# EAGLE design TauryCurrentSenseAmp (EAGLE 6.4)
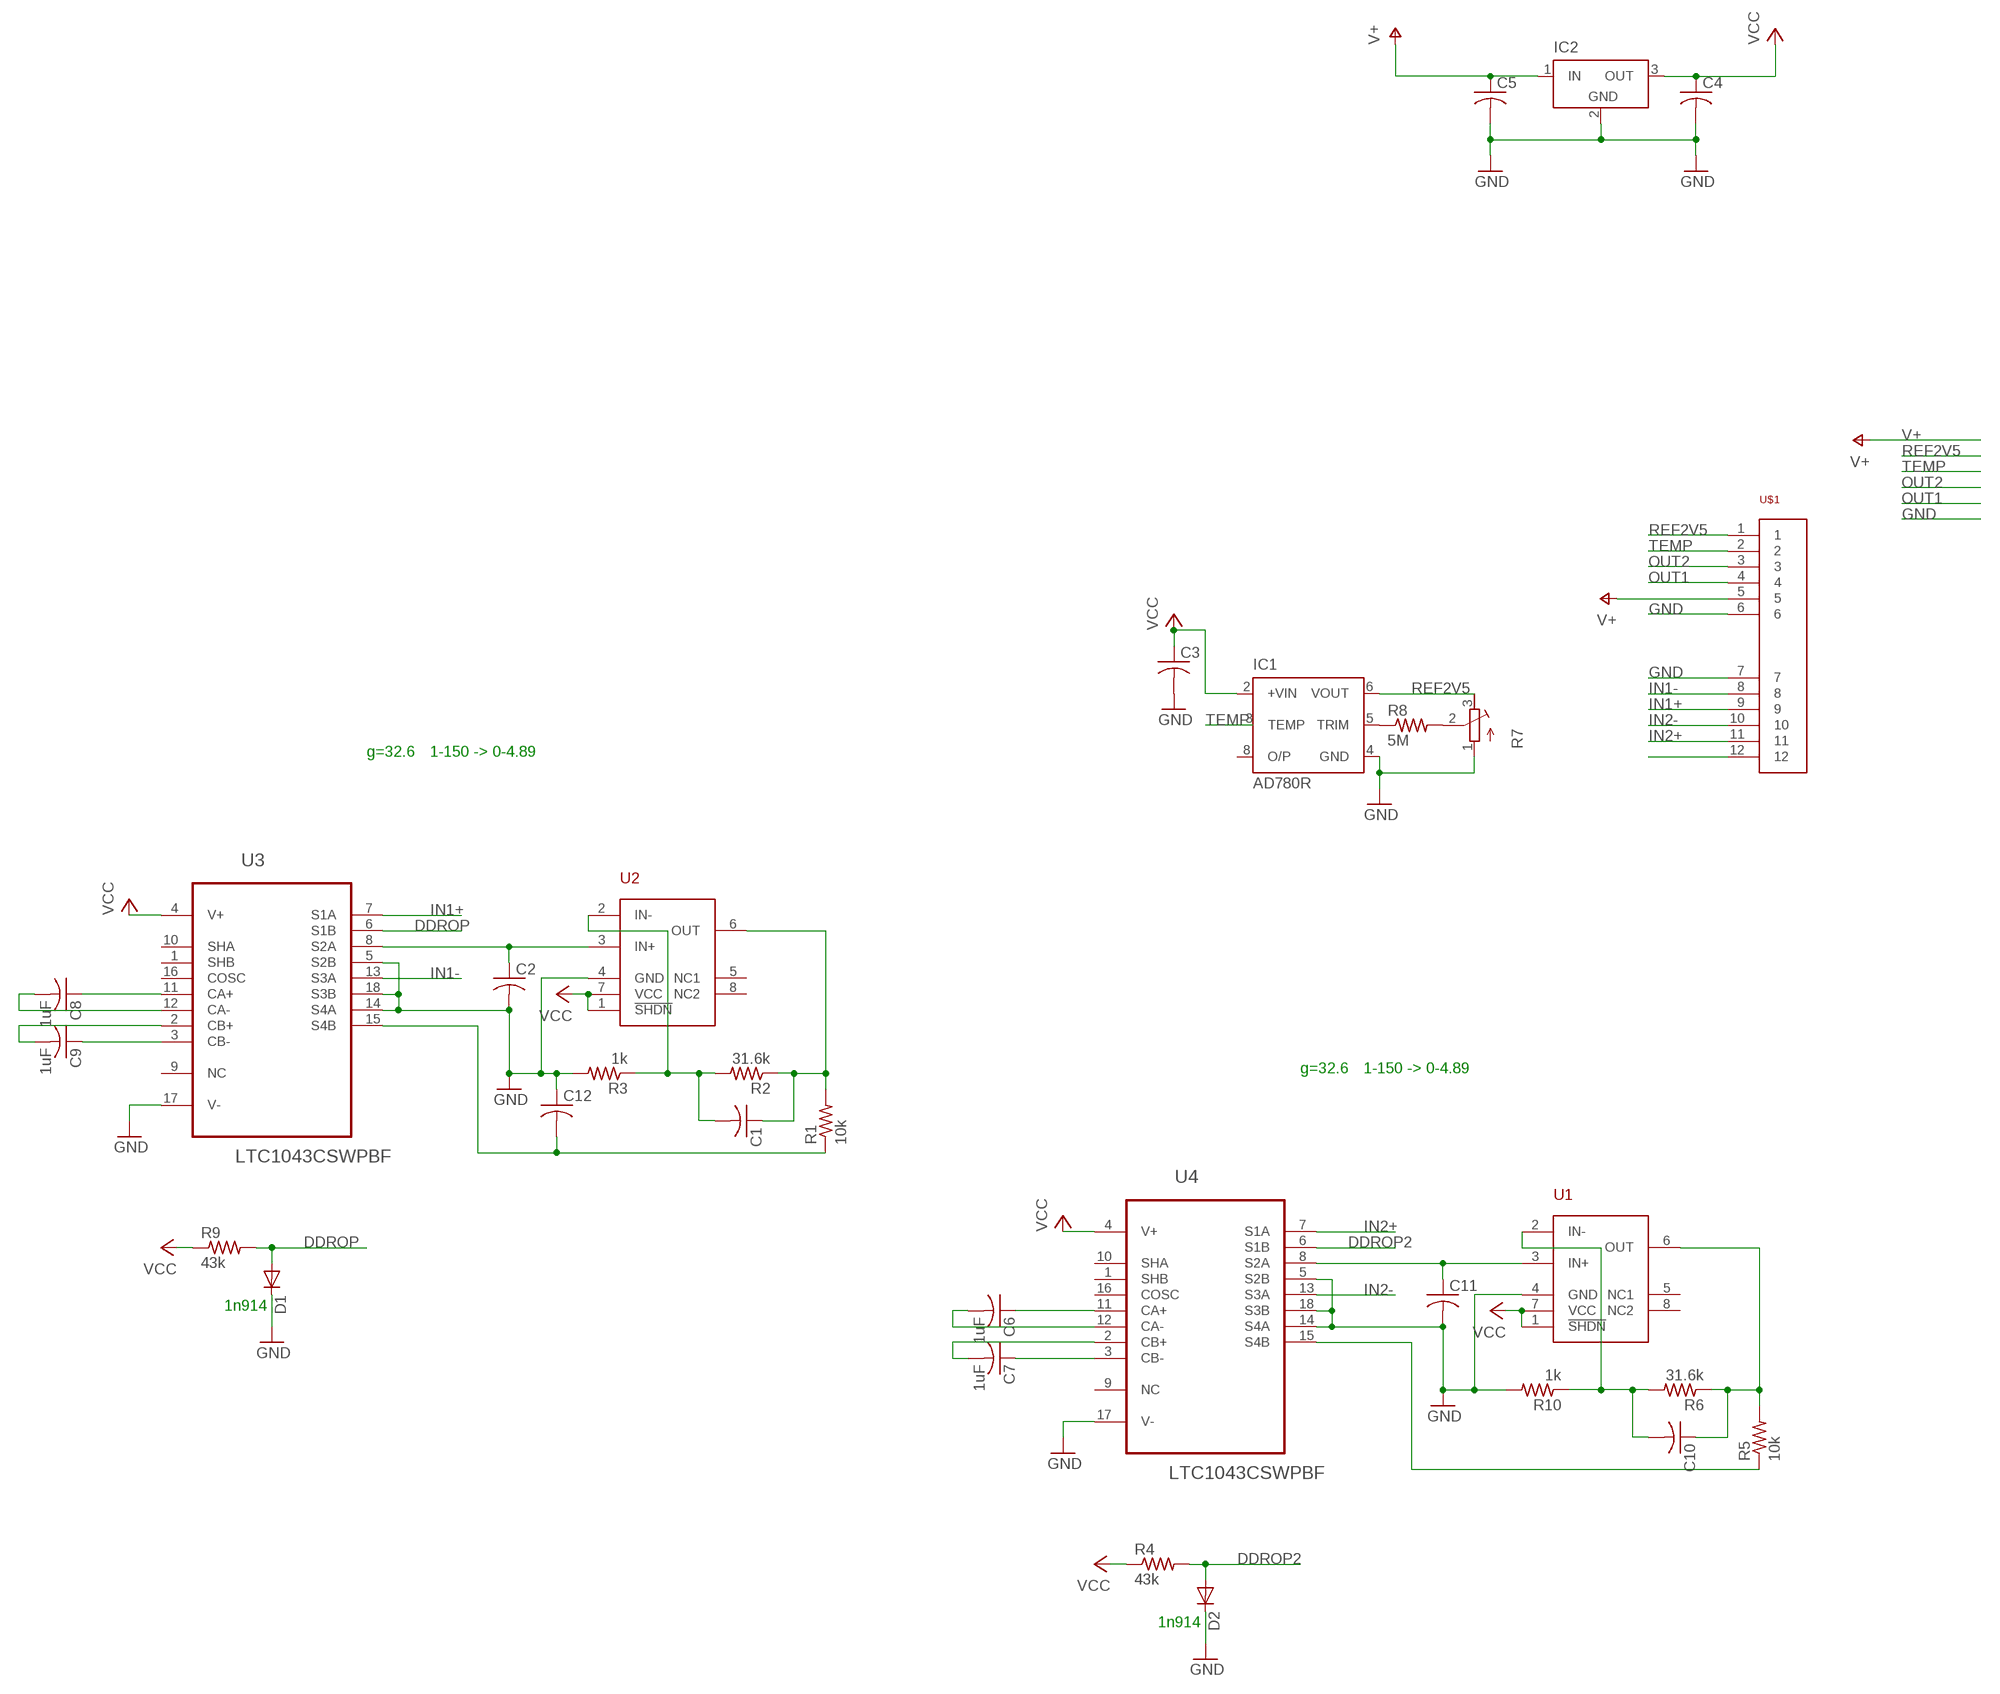
[diagram p0: schematic, sheet 1]

## Parts
C1  C-USC0805  [C0805]
C2  C-USC0805  [C0805]
C3  C-USC0805  [C0805]
C4  C-USC0805  [C0805]
C5  C-USC0805  [C0805]
C6  1uF  C-USC0805  [C0805]
C7  1uF  C-USC0805  [C0805]
C8  1uF  C-USC0805  [C0805]
C9  1uF  C-USC0805  [C0805]
C10  C-USC0805  [C0805]
C11  C-USC0805  [C0805]
C12  C-USC0805  [C0805]
D1  DIODE-SOD323-R  [SOD323-R]
D2  DIODE-SOD523  [SOD523]
IC1  AD780R  [SO8]
IC2  LT1129CST5  [SOT223]
R1  10k  R-US_R0805  [R0805]
R2  31.6k  R-US_R0805  [R0805]
R3  1k  R-US_R0805  [R0805]
R4  43k  R-US_R0805  [R0805]
R5  10k  R-US_R0805  [R0805]
R6  31.6k  R-US_R0805  [R0805]
R7  R-TRIMM5W  [RTRIM5W]
R8  5M  R-US_R0805  [R0805]
R9  43k  R-US_R0805  [R0805]
R10  1k  R-US_R0805  [R0805]
U1  MAX4239  [SO8]
U2  MAX4239  [SO8]
U3  LTC1043CSWPBF  [SOIC127P1032X264-18N]
U4  LTC1043CSWPBF  [SOIC127P1032X264-18N]
U$1  DMB-4770  [DMB-4770-PCB]

## Nets
DDROP: D1.A R9.2 U3.6(S1B)
DDROP2: D2.A R4.2 U4.6(S1B)
GND: C2.2 C3.2 C4.2 C5.2 C11.2 C12.1 D1.C D2.C IC1.4(GND) IC2.2(GND) R3.2 R7.1(A) R10.2 U1.4(GND) U2.4(GND) U3.5(S2B) U3.14(S4A) U3.17(V-) U3.18(S3B) U4.5(S2B) U4.14(S4A) U4.17(V-) U4.18(S3B) U$1.6 U$1.7
IN1+: U3.7(S1A) U$1.9
IN1-: U3.13(S3A) U$1.8
IN2+: U4.7(S1A) U$1.11
IN2-: U4.13(S3A) U$1.10
N$1: C2.1 U2.3(IN+) U3.8(S2A)
N$2: C12.2 R1.1 U3.15(S4B)
N$3: C6.1 U4.11(CA+)
N$4: C1.2 R2.2 R3.1 U2.2(IN-)
N$5: IC1.5(TRIM) R8.1
N$6: R7.2(S) R8.2
N$7: C8.1 U3.11(CA+)
N$8: C8.2 U3.12(CA-)
N$9: C9.2 U3.2(CB+)
N$10: C9.1 U3.3(CB-)
N$14: U$1.12
N$15: C6.2 U4.12(CA-)
N$16: C7.2 U4.2(CB+)
N$17: C7.1 U4.3(CB-)
N$18: C11.1 U1.3(IN+) U4.8(S2A)
N$19: R5.1 U4.15(S4B)
N$20: C10.2 R6.2 R10.1 U1.2(IN-)
OUT1: C1.1 R1.2 R2.1 U2.6(OUT) U$1.4
OUT2: C10.1 R5.2 R6.1 U1.6(OUT) U$1.3
REF2V5: IC1.6(VOUT) R7.3(E) U$1.1
TEMP: IC1.3(TEMP) U$1.2
V+: C5.1 IC2.1(IN) U$1.5
VCC: C3.1 C4.1 IC1.2(+VIN) IC2.3(OUT) R4.1 R9.1 U1.1(!SHDN) U1.7(VCC) U2.1(!SHDN) U2.7(VCC) U3.4(V+) U4.4(V+)
Unconnected: IC1.8(O/P) U1.5(NC1) U1.8(NC2) U2.5(NC1) U2.8(NC2) U3.1(SHB) U3.9(NC) U3.10(SHA) U3.16(COSC) U4.1(SHB) U4.9(NC) U4.10(SHA) U4.16(COSC)

## Notes on the sheet
- g=32.6 | 1-150 -> 0-4.89
- g=32.6 | 1-150 -> 0-4.89
- 1n914
- 1n914

## Power pins joined to a net without a drawn wire
GND: IC2.4(GND)

## Library data of the parts
C1-C12 = rcl:C-US: CAPACITOR, American symbol
D1 D2 = diode:DIODE-: DIODE
IC1 = analog-devices:AD780: High Precision Reference 2.5V/3.0V Source: http://www.analog.com/UploadedFiles/Data_Sheets/AD780.pdf; MPN: AD780BRZ-REEL; OC_FARNELL: 1464655; OC_NEWARK: 12M8938
IC2 = linear-technology:LT1129CST5: VOLTAGE REGULATOR with shutdown; MPN: LT1129CST-5#PBF; OC_FARNELL: 1663375; OC_NEWARK: 57M2069
R1-R6 R8-R10 = rcl:R-US_: RESISTOR, American symbol
R7 = rcl:R-TRIMM: Trimm resistor
U1 U2 = max4239:MAX4239
U3 U4 = LTC_By_element14_Batch_1:LTC1043CSWPBF: Dual Precision Instrumentation Switched Capacitor Building Block; MPN: LTC1043CSW#PBF; OC_FARNELL: 1663591; OC_NEWARK: 55M8881; PACKAGE: SOIC-18; SUPPLIER: Linear Technology
U$1 = DMB-4770-pcb:DMB-4770

## Board
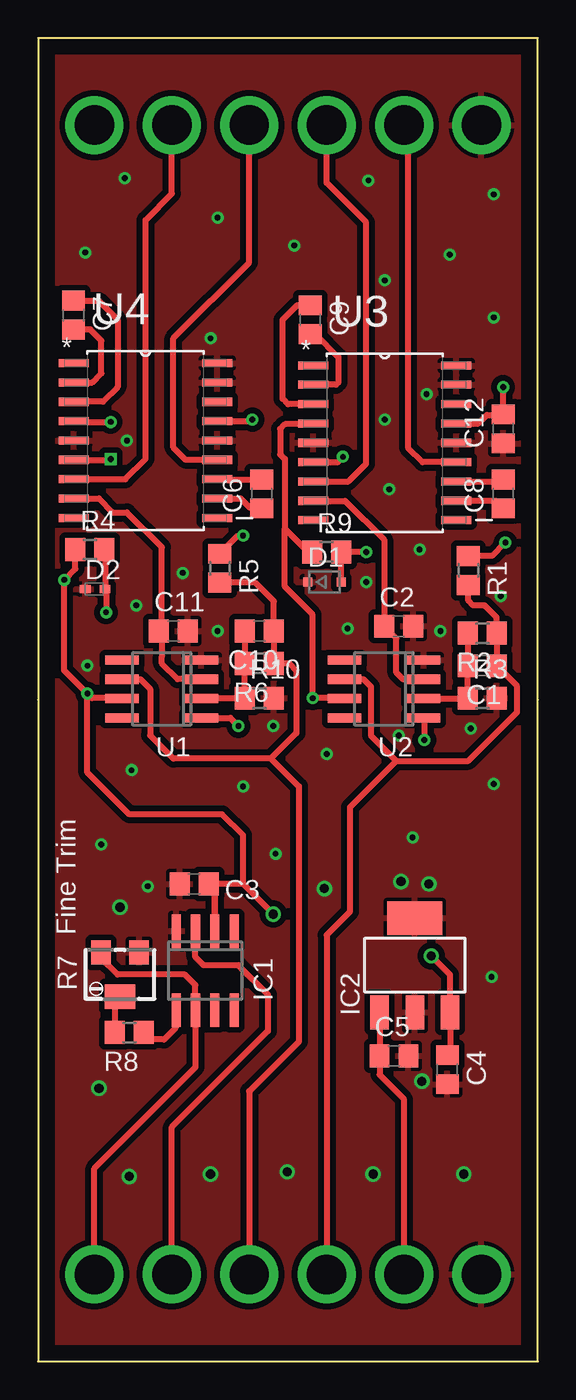
[diagram p1: board, top side]
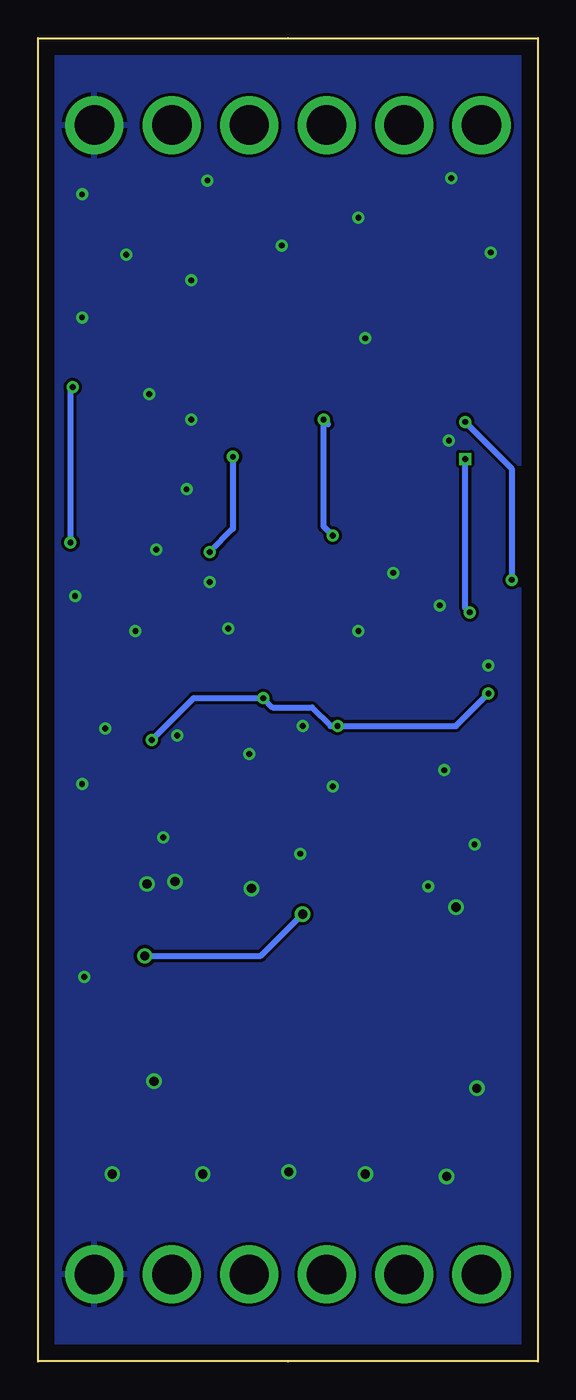
[diagram p2: board, bottom side, seen from below]

Size 32.79 x 86.87 mm. Coordinates in mm from the lower left corner, seen from the top.
Copper layers (1*16): Top 0.035mm / dielectric 1.5mm / Bottom 0.035mm
Design rules "default": minimum track width 10mil, minimum drill 24mil, track to track 8mil, track to pad 8mil, pad to pad 8mil, via to via 8mil, smd to smd 8mil, copper to edge 40mil, drill to drill 8mil, minimum pad ring 10mil, minimum via ring 8mil, stop-mask expansion 4mil, vias tented up to drill 0mil, thermal gap 10mil

### Footprints (pad centres in the part's own frame; a part is rotated, then mirrored left to right if it is on the bottom)
C0805 = smd 1.3 x 1.5: 1 -0.95,0; 2 0.95,0
SOD323-R = smd 0.6 x 0.6: A 1.1,0; C -1.1,0
SOD523 = smd 0.7 x 0.5: A 0.7,0; C -0.6,0
SO8 = smd 0.6 x 2.2: 1 -1.905,-2.6; 2 -0.635,-2.6; 3 0.635,-2.6; 4 1.905,-2.6; 5 1.905,2.6; 6 0.635,2.6; 7 -0.635,2.6; 8 -1.905,2.6
SOT223 = smd 1.219 x 2.235: 1 -2.311,-3.099; 2 0,-3.099; 3 2.311,-3.099 | smd 3.6 x 2.2: 4 0,3.099
R0805 = smd 1.3 x 1.5: 1 -0.95,0; 2 0.95,0
RTRIM5W = smd 1.3 x 1.6: 1 -1.25,-1.45; 3 1.25,-1.45 | smd 2 x 1.6: 2 0,1.45
SOIC127P1032X264-18N = smd 1.981 x 0.533: 1 -4.699,5.08; 2 -4.699,3.81; 3 -4.699,2.54; 4 -4.699,1.27; 5 -4.699,0; 6 -4.699,-1.27; 7 -4.699,-2.54; 8 -4.699,-3.81; 9 -4.699,-5.08; 10 4.699,-5.08; 11 4.699,-3.81; 12 4.699,-2.54; 13 4.699,-1.27; 14 4.699,0; 15 4.699,1.27; 16 4.699,2.54; 17 4.699,3.81; 18 4.699,5.08
DMB-4770-PCB = drill 2.591 pad 3.81: 1 -12.7,-37.719; 2 -7.62,-37.719; 3 -2.54,-37.719; 4 2.54,-37.719; 5 7.62,-37.719; 6 12.7,-37.719; 7 12.7,37.719; 8 7.62,37.719; 9 2.54,37.719; 10 -2.54,37.719; 11 -7.62,37.719; 12 -12.7,37.719

### Placement (x,y rotation side)
C1  29.15,45.67 180 top
C2  23.66,48.26 0 top
C3  10.25,31.34 180 top
C4  26.86,19.15 270 top
C5  23.36,20.07 0 top
C6  14.67,56.95 90 top
C7  2.32,68.68 270 top
C8  30.52,56.95 90 top
C9  17.87,68.38 270 top
C10  14.52,47.96 180 top
C11  8.88,47.96 0 top
C12  30.52,61.21 90 top
D1  18.78,51.16 0 top
D2  3.7,50.7 0 top
IC1  10.96,25.65 180 top
IC2  24.73,26.01 0 top
R1  28.23,51.92 270 top
R2  29.15,47.8 180 top
R3  29.15,43.54 0 top
R4  3.39,53.29 0 top
R5  11.93,52.07 270 top
R6  14.52,45.82 180 top
R7  5.37,25.4 180 top
R8  5.98,21.59 180 top
R9  18.94,53.14 0 top
R10  14.52,43.54 0 top
U1  8.12,44.15 90 top
U2  22.69,44.15 90 top
U3  22.75,60.3 0 top
U4  7.05,60.45 0 top
U$1  16.4,43.43 0 top

### Tracks (layer width: path | path; a pad name or v marks a point on that pad's centre or on a via)
DDROP  (via drill 0.38)
  Top 0.406: D1.A R9.2 v21.53,53.14 | U3.6 19.65,59.03 v20,59.38
  Bottom 0.406: v20,59.38 20,54.66 v21.53,53.14
DDROP2  (via drill 0.38)
  Top 0.406: U4.6 4.71,59.18 v4.76,59.23 | R4.2 4.4,53.23 D2.A 4.46,50.64 v4.46,49.17
  Bottom 0.406: v4.46,49.17 4.76,49.48 v4.76,59.23
GND  (via drill 0.38, 0.6)
  other vias: 18.78,31.04 16.34,12.45 21.98,12.29 11.32,12.29 5.98,12.14 4,17.93 5.37,29.82 25.64,31.34 23.81,31.5 25.18,18.39 27.93,12.29 6.44,49.63 15.43,41.71 28.38,41.55 23.66,41.1 20.31,48.11 21.53,51.16 30.37,50.24 25.03,53.29 22.75,61.82 22.75,70.97 15.58,33.32 13.45,37.74 6.13,38.81 4.15,33.93 7.2,31.19 24.57,34.39 29.91,37.9 29.76,25.25 18.94,39.88 26.4,47.96 23.05,57.25 25.49,63.5 27.01,72.64 29.91,68.53 29.91,76.61 21.68,77.52 16.8,73.25 11.77,75.08 3.09,72.8 5.68,77.67 11.32,67.16 5.83,60.45 9.49,51.77 11.77,47.96 3.24,45.67
  pour Top (isolate 0.381): 0.14,86.87 32.91,86.87 32.91,0 0.14,0
  pour Bottom: 0.04,86.97 32.8,86.97 32.8,-0.05 0.04,-0.05
IN1+
  Top 0.406: U3.7 20.36,57.76 21.53,58.93 21.53,74.78 18.94,77.37 U$1.9
IN1-
  Top 0.406: U3.13 25.23,59.03 24.27,59.99 24.27,80.9 U$1.8
IN2+
  Top 0.406: U4.7 5.73,57.91 7.05,59.23 7.05,74.93 8.78,76.66 U$1.11
IN2-
  Top 0.406: U4.13 9.69,59.18 8.88,59.99 8.88,67.16 13.86,72.14 U$1.10
N$1
  Top 0.406: U2.3 23.94,44.78 23.51,45.21 23.51,47.46 C2.1 22.71,53.93 20.15,56.49 U3.8
N$2  (via drill 0.38)
  Top 0.406: U3.15 28.89,61.57 29.45,62.13 30.48,62.13 | 30.48,62.13 C12.2 | 30.48,62.13 30.52,62.13 v30.52,63.96 | v30.67,53.75 29.79,52.87 R1.1
  Bottom 0.406: v30.52,63.96 30.67,63.8 v30.67,53.75
N$3
  Top 0.406: U4.11 13.3,56.64 13.91,56.03 14.63,56.03 C6.1
N$4
  Top 0.406: U2.2 28.17,43.51 R3.1 C1.2 R2.2
N$5
  Top 0.406: IC1.5 9.03,23.03 9.03,21.89 8.27,21.13 6.93,21.13 R8.1
N$6
  Top 0.406: R7.2 5.03,23.61 R8.2
N$7
  Top 0.406: C8.1 30.03,56.49 U3.11
N$8
  Top 0.406: U3.12 30.38,57.76 C8.2
N$9
  Top 0.406: C9.2 18.21,67.43 19.7,65.94 19.7,64.26 19.55,64.11 U3.2
N$10
  Top 0.406: U3.3 16.4,62.84 16.04,63.2 16.04,68.38 16.99,69.33 C9.1
N$15
  Top 0.406: U4.12 11.76,57.9 C6.2
N$16
  Top 0.406: U4.2 3.54,64.26 4.15,64.87 4.15,67 3.43,67.73 C7.2
N$17
  Top 0.406: C7.1 3.96,69.63 5.22,68.38 5.22,63.96 4.25,62.99 U4.3
N$18
  Top 0.406: U4.8 4,56.64 4.91,55.73 5.83,55.73 8.12,53.44 8.12,47.77 | U1.3 9.16,44.78 8.12,45.82 8.12,46.28 8.12,47.77 | C11.1 8.12,47.77
N$19  (via drill 0.38)
  Top 0.406: U4.15 13.96,61.72 v14.06,61.82 | R5.1 13.11,54.2 v13.45,54.2
  Bottom 0.406: 13.75,61.52 v14.06,61.82 14.06,54.81 v13.45,54.2
N$20
  Top 0.406: U1.2 10.74,43.54 R10.1 R6.2 C10.2
OUT1
  Top 0.406: U2.6 21.35,44.78 21.83,44.3 21.83,41.1 23.51,39.42 | 23.51,39.42 28.23,39.42 31.43,42.62 31.43,44.33 C1.1 R2.1 30.1,48.83 29.3,49.63 28.54,49.63 28.23,49.94 R1.2 | 23.51,39.42 20.46,36.37 20.46,29.51 18.94,27.99 U$1.4
OUT2
  Top 0.406: R5.2 14.25,51.12 15.47,49.9 C10.1 R6.1 16.5,45.82 16.95,45.36 16.95,41.25 15.28,39.57 | 15.28,39.57 8.88,39.57 7.35,41.1 7.35,44.14 6.72,44.78 U1.6 | 15.28,39.57 17.11,37.74 17.11,20.98 13.86,17.73 U$1.3
REF2V5
  Top 0.406: R7.3 4.12,26.5 5.22,25.4 9.64,25.4 10.32,24.71 IC1.6 10.32,19.3 3.7,12.67 U$1.1
TEMP
  Top 0.406: IC1.3 10.32,26.54 10.86,26.01 13.14,26.01 15.07,24.08 15.07,21.69 8.78,15.39 U$1.2
V+
  Top 0.406: IC2.1 C5.1 22.41,18.81 24.02,17.2 U$1.5
VCC  (via drill 0.38, 0.6)
  Top 0.406: v25.79,26.62 27.04,25.37 IC2.3 27.04,20.28 C4.1 | 11.62,31.34 11.59,31.32 IC1.2 11.59,30.95 C3.1 13.45,31.34 | v15.43,29.36 13.45,31.34 | U4.4 2.4,61.67 v4.76,61.67 | R4.1 2.44,52.03 v1.71,51.31 1.71,45.36 v3.24,43.84 | U1.7 5.49,43.54 3.54,43.54 v3.24,43.84 | U1.1 12.61,42.24 v13.14,41.71 | U2.7 20.07,43.54 v18.02,43.54 18.02,49.02 16.19,50.85 16.19,54.66 | U3.4 18,61.52 16.19,61.52 15.89,61.21 15.89,59.54 16.19,59.23 16.19,54.66 | 16.19,54.66 17.72,53.14 R9.1 | U2.1 25.34,42.2 v25.34,40.79 | 13.45,31.34 13.45,34.54 12.08,35.92 5.98,35.92 3.24,38.66 v3.24,43.84
  Bottom 0.406: v25.79,26.62 18.17,26.62 v15.43,29.36 | v4.76,61.67 1.71,58.62 v1.71,51.31 | v3.24,43.84 5.37,41.71 v13.14,41.71 13.6,41.71 14.82,42.93 17.41,42.93 v18.02,43.54 22.59,43.54 v25.34,40.79

### Text on the board
tNames: Fine Trim